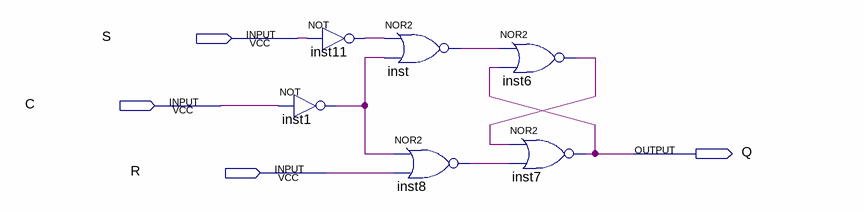
[diagram p0: schematic sheet]
// Quartus schematic RS.bdf as structural Verilog: 6 symbols, 4 pins
module RS (
  input  S,
  input  C,
  input  R,
  output Q
);

  wire inst1_out, inst6_out, inst8_out, inst11_out, inst_out;

  not inst11 (inst11_out, S);
  not inst1 (inst1_out, C);
  nor inst (inst_out, inst11_out, inst1_out);
  nor inst8 (inst8_out, inst1_out, R);
  nor inst6 (inst6_out, inst_out, Q);
  nor inst7 (Q, inst6_out, inst8_out);
endmodule
